# EAGLE schematic Submarine (EAGLE 9.2.2)
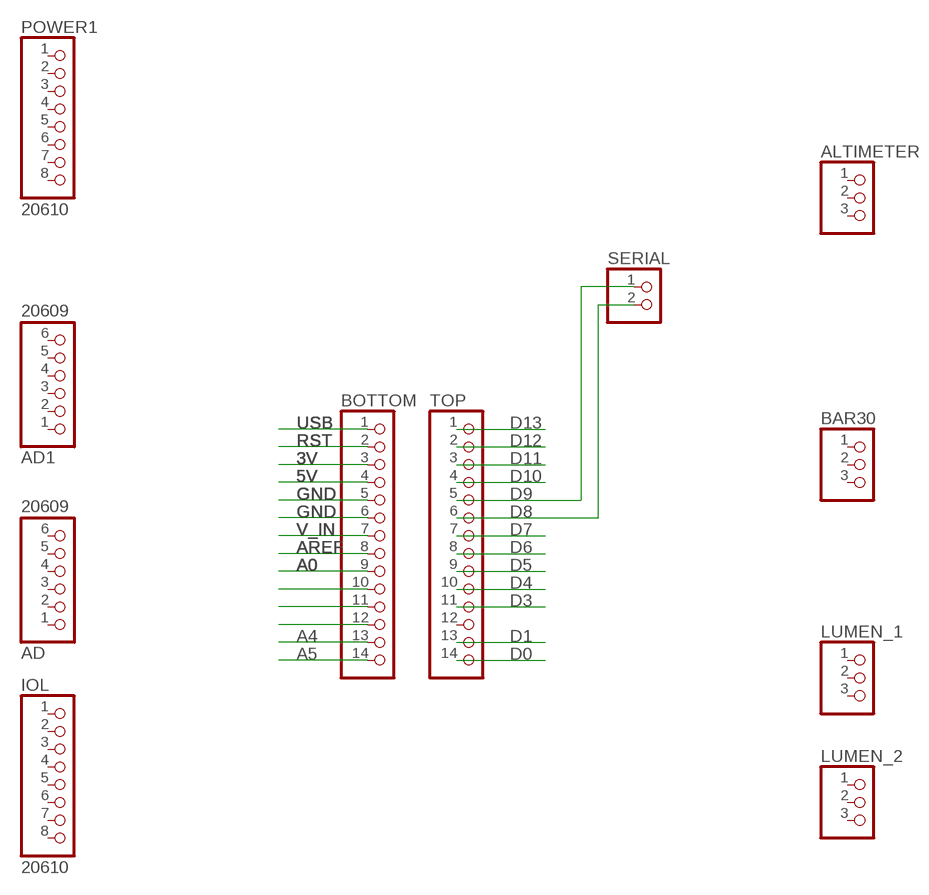
[diagram p0: schematic, sheet 1]

## Parts
AD  20609  HEADER-1X6ROUND  [1X06_ROUND]
AD1  20609  HEADER-1X6ROUND  [1X06_ROUND]
ALTIMETER  PINHD-1X3  [1X03]
BAR30  PINHD-1X3  [1X03]
BOTTOM  PINHD-1X14  [1X14]
IOL  20610  HEADER-1X8ROUND  [1X08_ROUND]
LUMEN_1  PINHD-1X3  [1X03]
LUMEN_2  PINHD-1X3  [1X03]
POWER1  20610  HEADER-1X870MIL  [1X08_ROUND_70]
SERIAL  PINHD-1X2  [1X02]
TOP  PINHD-1X14  [1X14]

## Nets
3V: BOTTOM.3
5V: BOTTOM.4
A0: BOTTOM.9
A4: BOTTOM.13
A5: BOTTOM.14
AREF: BOTTOM.8
D0: TOP.14
D1: TOP.13
D3: TOP.11
D4: TOP.10
D5: TOP.9
D6: TOP.8
D7: TOP.7
D8: SERIAL.2 TOP.6
D9: SERIAL.1 TOP.5
D10: TOP.4
D11: TOP.3
D12: TOP.2
D13: TOP.1
GND: BOTTOM.5 BOTTOM.6
N$5: BOTTOM.12
N$6: BOTTOM.11
N$7: BOTTOM.10
RST: BOTTOM.2
USB: BOTTOM.1
V_IN: BOTTOM.7
Unconnected: AD1.1 AD1.2 AD1.3 AD1.4 AD1.5 AD1.6 AD.1 AD.2 AD.3 AD.4 AD.5 AD.6 ALTIMETER.1 ALTIMETER.2 ALTIMETER.3 BAR30.1 BAR30.2 BAR30.3 IOL.1 IOL.2 IOL.3 IOL.4 IOL.5 IOL.6 IOL.7 IOL.8 LUMEN_1.1 LUMEN_1.2 LUMEN_1.3 LUMEN_2.1 LUMEN_2.2 LUMEN_2.3 POWER1.1 POWER1.2 POWER1.3 POWER1.4 POWER1.5 POWER1.6 POWER1.7 POWER1.8 TOP.12

## Library data of the parts
AD AD1 = microbuilder:HEADER-1X6: PIN HEADER
ALTIMETER BAR30 LUMEN_1 LUMEN_2 = pinhead:PINHD-1X3: PIN HEADER
BOTTOM TOP = pinhead:PINHD-1X14: PIN HEADER
IOL POWER1 = microbuilder:HEADER-1X8: PIN HEADER
SERIAL = pinhead:PINHD-1X2: PIN HEADER